# Altium schematic sheet demux.SchDoc
size A4; SheetNumber: 6; SheetTotal: 14
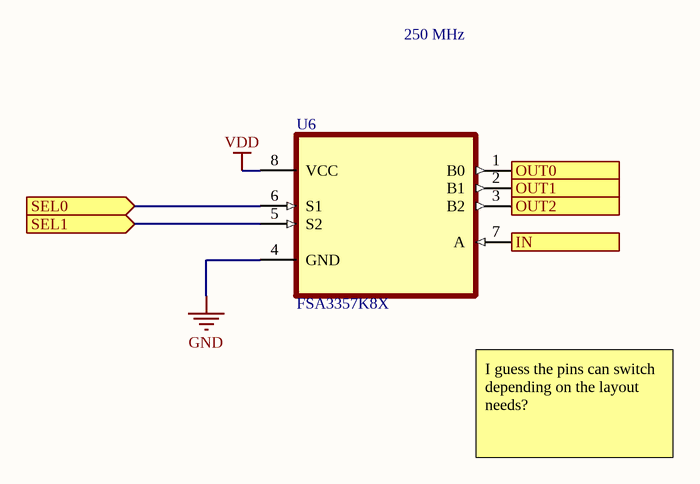
[diagram p0: demux.SchDoc]

## Parts
U6  FSA3357K8X  [SOP50P310X90-8N]

## Ports
IN (in), OUT0 (out), OUT1 (out), OUT2 (out), SEL0 (in), SEL1 (in)

## Nets
GND: U6.4(GND)
VDD: U6.8(VCC)
IN: U6.7(A) ; port IN
OUT0: U6.1(B0) ; port OUT0
OUT1: U6.2(B1) ; port OUT1
OUT2: U6.3(B2) ; port OUT2
SEL0: U6.6(S1) ; port SEL0
SEL1: U6.5(S2) ; port SEL1

## Notes on the sheet
- 250 MHz
- I guess the pins can switch depending on the layout needs?

## Library data of the parts
U6 = FSA3357K8X: Analog Switch ICs Multi/Demultiplexer LV 3:1 SP3T; Package: None; Price: None; Value: *; MP: FSA3357K8X; Availability: Unavailable; Part Number: FSA3357K8X; Supplier 1: Mouser; Supplier Part Number 1: 512-FSA3357K8X; Supplier URL 1: https://www.mouser.ca/ProductDetail/onsemi-Fairchild/FSA3357K8X?qs=sGAEpiMZZMtqBmg8fZQA6wYDAhwKfUHh; Manufacturer Part Number 1: FSA3357K8X